# EAGLE design FotoTr (EAGLE 7.2.0)
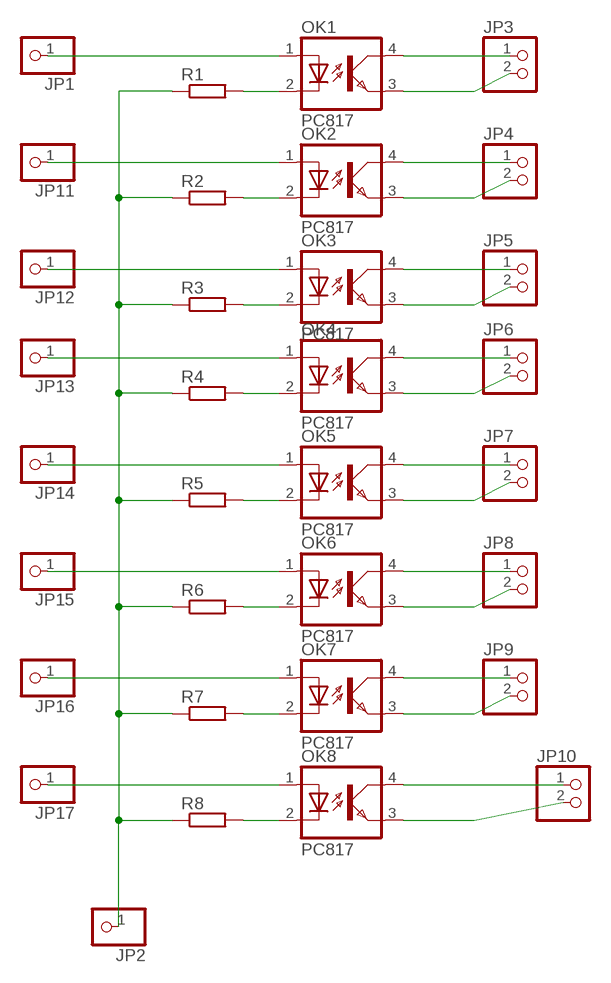
[diagram p0: schematic, sheet 1]

## Parts
JP1  PINHD-1X1  [1X01]
JP2  PINHD-1X1  [1X01]
JP3  PINHD-1X2  [1X02]
JP4  PINHD-1X2  [1X02]
JP5  PINHD-1X2  [1X02]
JP6  PINHD-1X2  [1X02]
JP7  PINHD-1X2  [1X02]
JP8  PINHD-1X2  [1X02]
JP9  PINHD-1X2  [1X02]
JP10  PINHD-1X2  [1X02]
JP11  PINHD-1X1  [1X01]
JP12  PINHD-1X1  [1X01]
JP13  PINHD-1X1  [1X01]
JP14  PINHD-1X1  [1X01]
JP15  PINHD-1X1  [1X01]
JP16  PINHD-1X1  [1X01]
JP17  PINHD-1X1  [1X01]
OK1  PC817  [DIL04]
OK2  PC817  [DIL04]
OK3  PC817  [DIL04]
OK4  PC817  [DIL04]
OK5  PC817  [DIL04]
OK6  PC817  [DIL04]
OK7  PC817  [DIL04]
OK8  PC817  [DIL04]
R1  R-EU_0204/2V  [0204V]
R2  R-EU_0204/2V  [0204V]
R3  R-EU_0204/2V  [0204V]
R4  R-EU_0204/2V  [0204V]
R5  R-EU_0204/2V  [0204V]
R6  R-EU_0204/2V  [0204V]
R7  R-EU_0204/2V  [0204V]
R8  R-EU_0204/2V  [0204V]

## Nets
N$1: OK1.2(C) R1.2
N$2: OK2.2(C) R2.2
N$3: OK3.2(C) R3.2
N$4: OK4.2(C) R4.2
N$5: OK5.2(C) R5.2
N$6: OK6.2(C) R6.2
N$7: OK7.2(C) R7.2
N$8: OK8.2(C) R8.2
N$9: JP2.1 R1.1 R2.1 R3.1 R4.1 R5.1 R6.1 R7.1 R8.1
N$10: JP1.1 OK1.1(A)
N$11: JP11.1 OK2.1(A)
N$12: JP12.1 OK3.1(A)
N$13: JP13.1 OK4.1(A)
N$14: JP14.1 OK5.1(A)
N$15: JP15.1 OK6.1(A)
N$16: JP16.1 OK7.1(A)
N$17: JP17.1 OK8.1(A)
N$18: JP3.1 OK1.4(COL)
N$19: JP3.2 OK1.3(EMIT)
N$20: JP4.1 OK2.4(COL)
N$21: JP4.2 OK2.3(EMIT)
N$22: JP5.1 OK3.4(COL)
N$23: JP5.2 OK3.3(EMIT)
N$24: JP6.1 OK4.4(COL)
N$25: JP6.2 OK4.3(EMIT)
N$26: JP7.1 OK5.4(COL)
N$27: JP7.2 OK5.3(EMIT)
N$28: JP8.1 OK6.4(COL)
N$29: JP8.2 OK6.3(EMIT)
N$30: JP9.1 OK7.4(COL)
N$31: JP9.2 OK7.3(EMIT)
N$32: JP10.1 OK8.4(COL)
N$33: JP10.2 OK8.3(EMIT)

## Library data of the parts
JP1 JP2 JP11-JP17 = pinhead:PINHD-1X1: PIN HEADER
JP3-JP10 = pinhead:PINHD-1X2: PIN HEADER
OK1-OK8 = optocoupler:PC817: SHARP OPTO COUPLER; MPN: PC817X4J000F; OC_FARNELL: 9707727; OC_NEWARK: 97K7059
R1-R8 = resistor:R-EU_: RESISTOR, European symbol

## Board
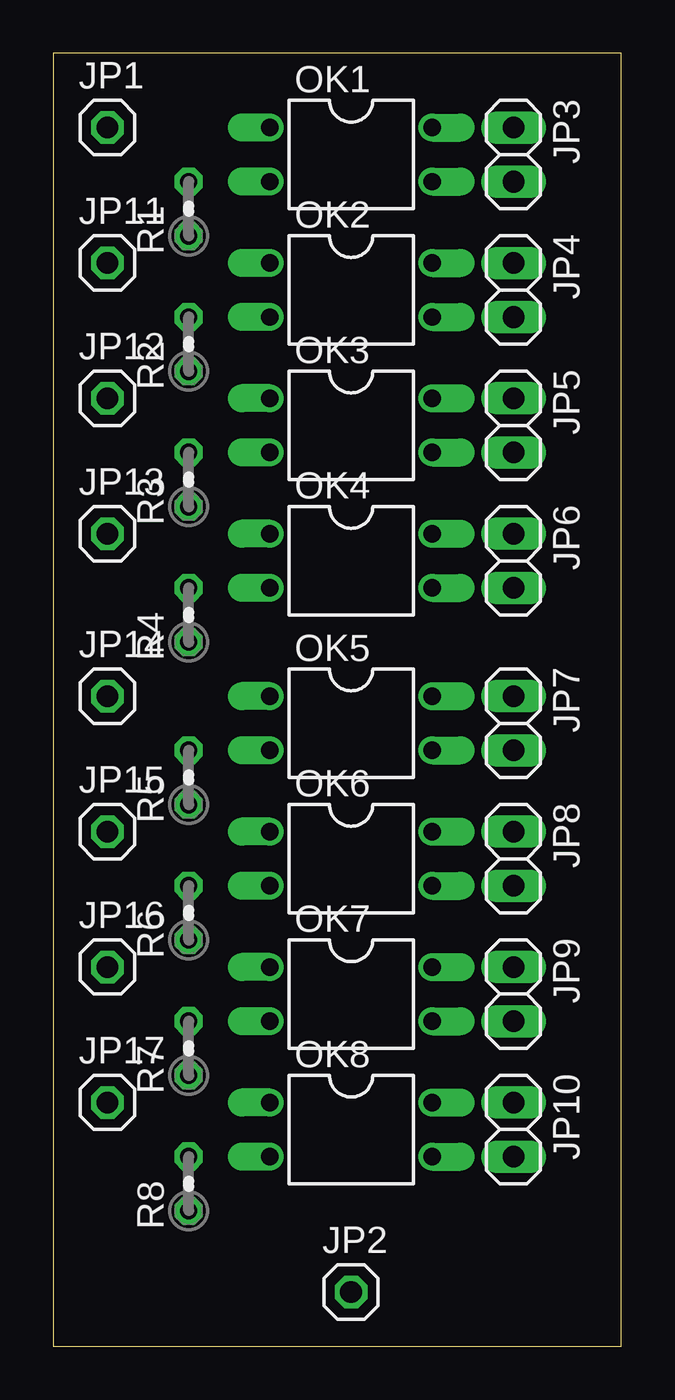
[diagram p1: board, top side]
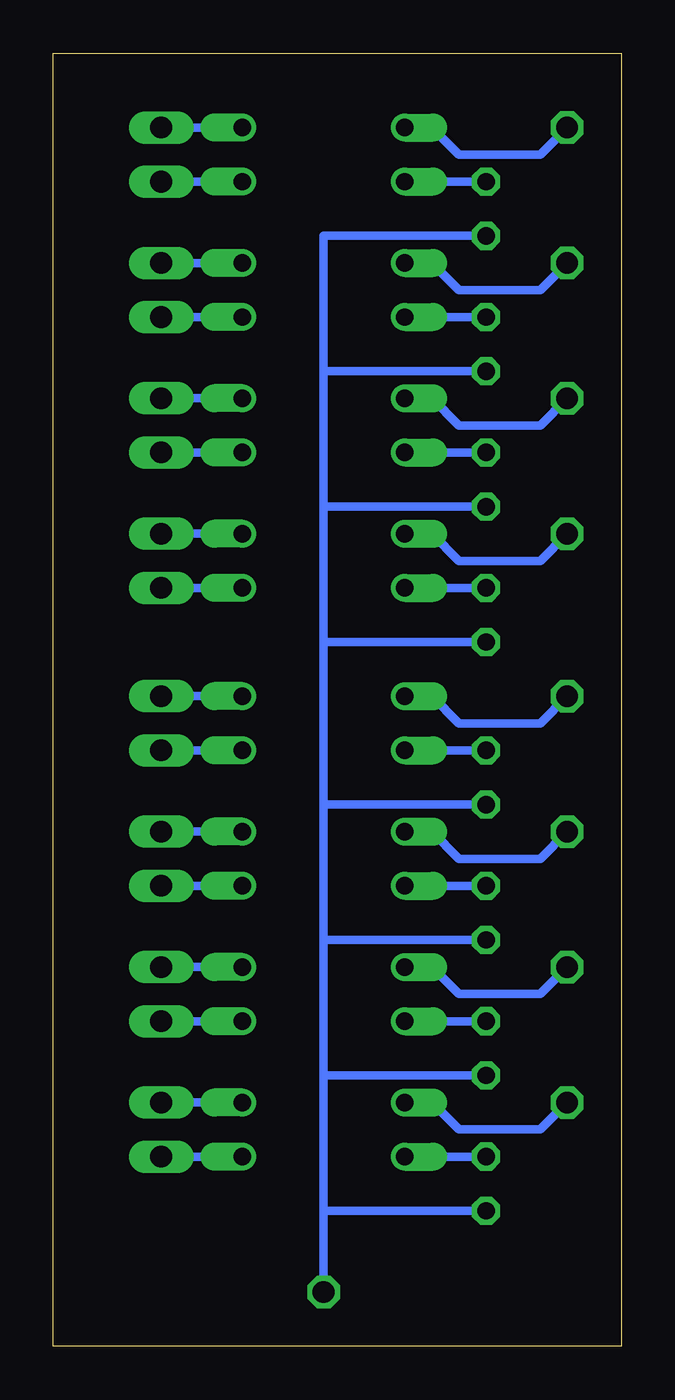
[diagram p2: board, bottom side, seen from below]

Size 26.65 x 60.63 mm. Coordinates in mm from the lower left corner, seen from the top.
Outline: 0,0 26.65,0 26.65,60.63 0,60.63 0,0
Copper layers (1*16): Top 0.035mm / dielectric 1.5mm / Bottom 0.035mm
Design rules "default": minimum track width 10mil, minimum drill 24mil, track to track 8mil, track to pad 8mil, pad to pad 8mil, via to via 8mil, smd to smd 8mil, copper to edge 40mil, drill to drill 8mil, minimum pad ring 10mil, minimum via ring 8mil, stop-mask expansion 4mil, vias tented up to drill 0mil, thermal gap 10mil

### Footprints (pad centres in the part's own frame; a part is rotated, then mirrored left to right if it is on the bottom)
1X01 = drill 1.016 octagon: 1 0,0
1X02 = drill 1.016 long: 1 -1.27,0; 2 1.27,0
DIL04 = drill 0.813 offset: 1 -1.27,-3.81; 2 1.27,-3.81; 3 1.27,3.81; 4 -1.27,3.81
0204V = drill 0.813 octagon: 1 -1.27,0; 2 1.27,0

### Placement (x,y rotation side)
JP1  2.54,57.15 0 top
JP2  13.97,2.54 0 top
JP3  21.59,55.88 270 top
JP4  21.59,49.53 270 top
JP5  21.59,43.18 270 top
JP6  21.59,36.83 270 top
JP7  21.59,29.21 270 top
JP8  21.59,22.86 270 top
JP9  21.59,16.51 270 top
JP10  21.59,10.16 270 top
JP11  2.54,50.8 0 top
JP12  2.54,44.45 0 top
JP13  2.54,38.1 0 top
JP14  2.54,30.48 0 top
JP15  2.54,24.13 0 top
JP16  2.54,17.78 0 top
JP17  2.54,11.43 0 top
OK1  13.97,55.88 270 top
OK2  13.97,49.53 270 top
OK3  13.97,43.18 270 top
OK4  13.97,36.83 270 top
OK5  13.97,29.21 270 top
OK6  13.97,22.86 270 top
OK7  13.97,16.51 270 top
OK8  13.97,10.16 270 top
R1  6.35,53.34 90 top
R2  6.35,46.99 90 top
R3  6.35,40.64 90 top
R4  6.35,34.29 90 top
R5  6.35,26.67 90 top
R6  6.35,20.32 90 top
R7  6.35,13.97 90 top
R8  6.35,7.62 90 top

### Tracks (layer width: path | path; a pad name or v marks a point on that pad's centre or on a via)
N$1
  Bottom 0.406: R1.2 OK1.2
N$2
  Bottom 0.406: OK2.2 R2.2
N$3
  Bottom 0.406: OK3.2 R3.2
N$4
  Bottom 0.406: OK4.2 R4.2
N$5
  Bottom 0.406: OK5.2 R5.2
N$6
  Bottom 0.406: OK6.2 R6.2
N$7
  Bottom 0.406: OK7.2 R7.2
N$8
  Bottom 0.406: OK8.2 R8.2
N$9
  Bottom 0.406: R1.1 13.97,52.07 13.97,45.72 | 13.97,45.72 13.97,39.37 | 13.97,39.37 13.97,33.02 | 13.97,33.02 13.97,25.4 | 13.97,25.4 13.97,19.05 | 13.97,19.05 13.97,12.7 | 13.97,12.7 13.97,6.35 | 13.97,6.35 R8.1 | R2.1 13.97,45.72 | R3.1 13.97,39.37 | R4.1 13.97,33.02 | R5.1 13.97,25.4 | R7.1 13.97,12.7 | R6.1 13.97,19.05 | 13.97,6.35 JP2.1
N$10
  Bottom 0.406: JP1.1 3.81,55.88 7.62,55.88 8.89,57.15 OK1.1
N$11
  Bottom 0.406: JP11.1 3.81,49.53 7.62,49.53 8.89,50.8 OK2.1
N$12
  Bottom 0.406: JP12.1 3.81,43.18 7.62,43.18 8.89,44.45 OK3.1
N$13
  Bottom 0.406: JP13.1 3.81,36.83 7.62,36.83 8.89,38.1 OK4.1
N$14
  Bottom 0.406: JP14.1 3.81,29.21 7.62,29.21 8.89,30.48 OK5.1
N$15
  Bottom 0.406: JP15.1 3.81,22.86 7.62,22.86 8.89,24.13 OK6.1
N$16
  Bottom 0.406: JP16.1 3.81,16.51 7.62,16.51 8.89,17.78 OK7.1
N$17
  Bottom 0.406: JP17.1 3.81,10.16 7.62,10.16 8.89,11.43 OK8.1
N$18
  Bottom 0.406: OK1.4 JP3.1
N$19
  Bottom 0.406: OK1.3 JP3.2
N$20
  Bottom 0.406: OK2.4 JP4.1
N$21
  Bottom 0.406: OK2.3 JP4.2
N$22
  Bottom 0.406: OK3.4 JP5.1
N$23
  Bottom 0.406: OK3.3 JP5.2
N$24
  Bottom 0.406: OK4.4 JP6.1
N$25
  Bottom 0.406: OK4.3 JP6.2
N$26
  Bottom 0.406: OK5.4 JP7.1
N$27
  Bottom 0.406: OK5.3 JP7.2
N$28
  Bottom 0.406: OK6.4 JP8.1
N$29
  Bottom 0.406: OK6.3 JP8.2
N$30
  Bottom 0.406: OK7.4 JP9.1
N$31
  Bottom 0.406: OK7.3 JP9.2
N$32
  Bottom 0.406: OK8.4 JP10.1
N$33
  Bottom 0.406: OK8.3 JP10.2